# EAGLE design Pure Power Strip (EAGLE 9.6.2)
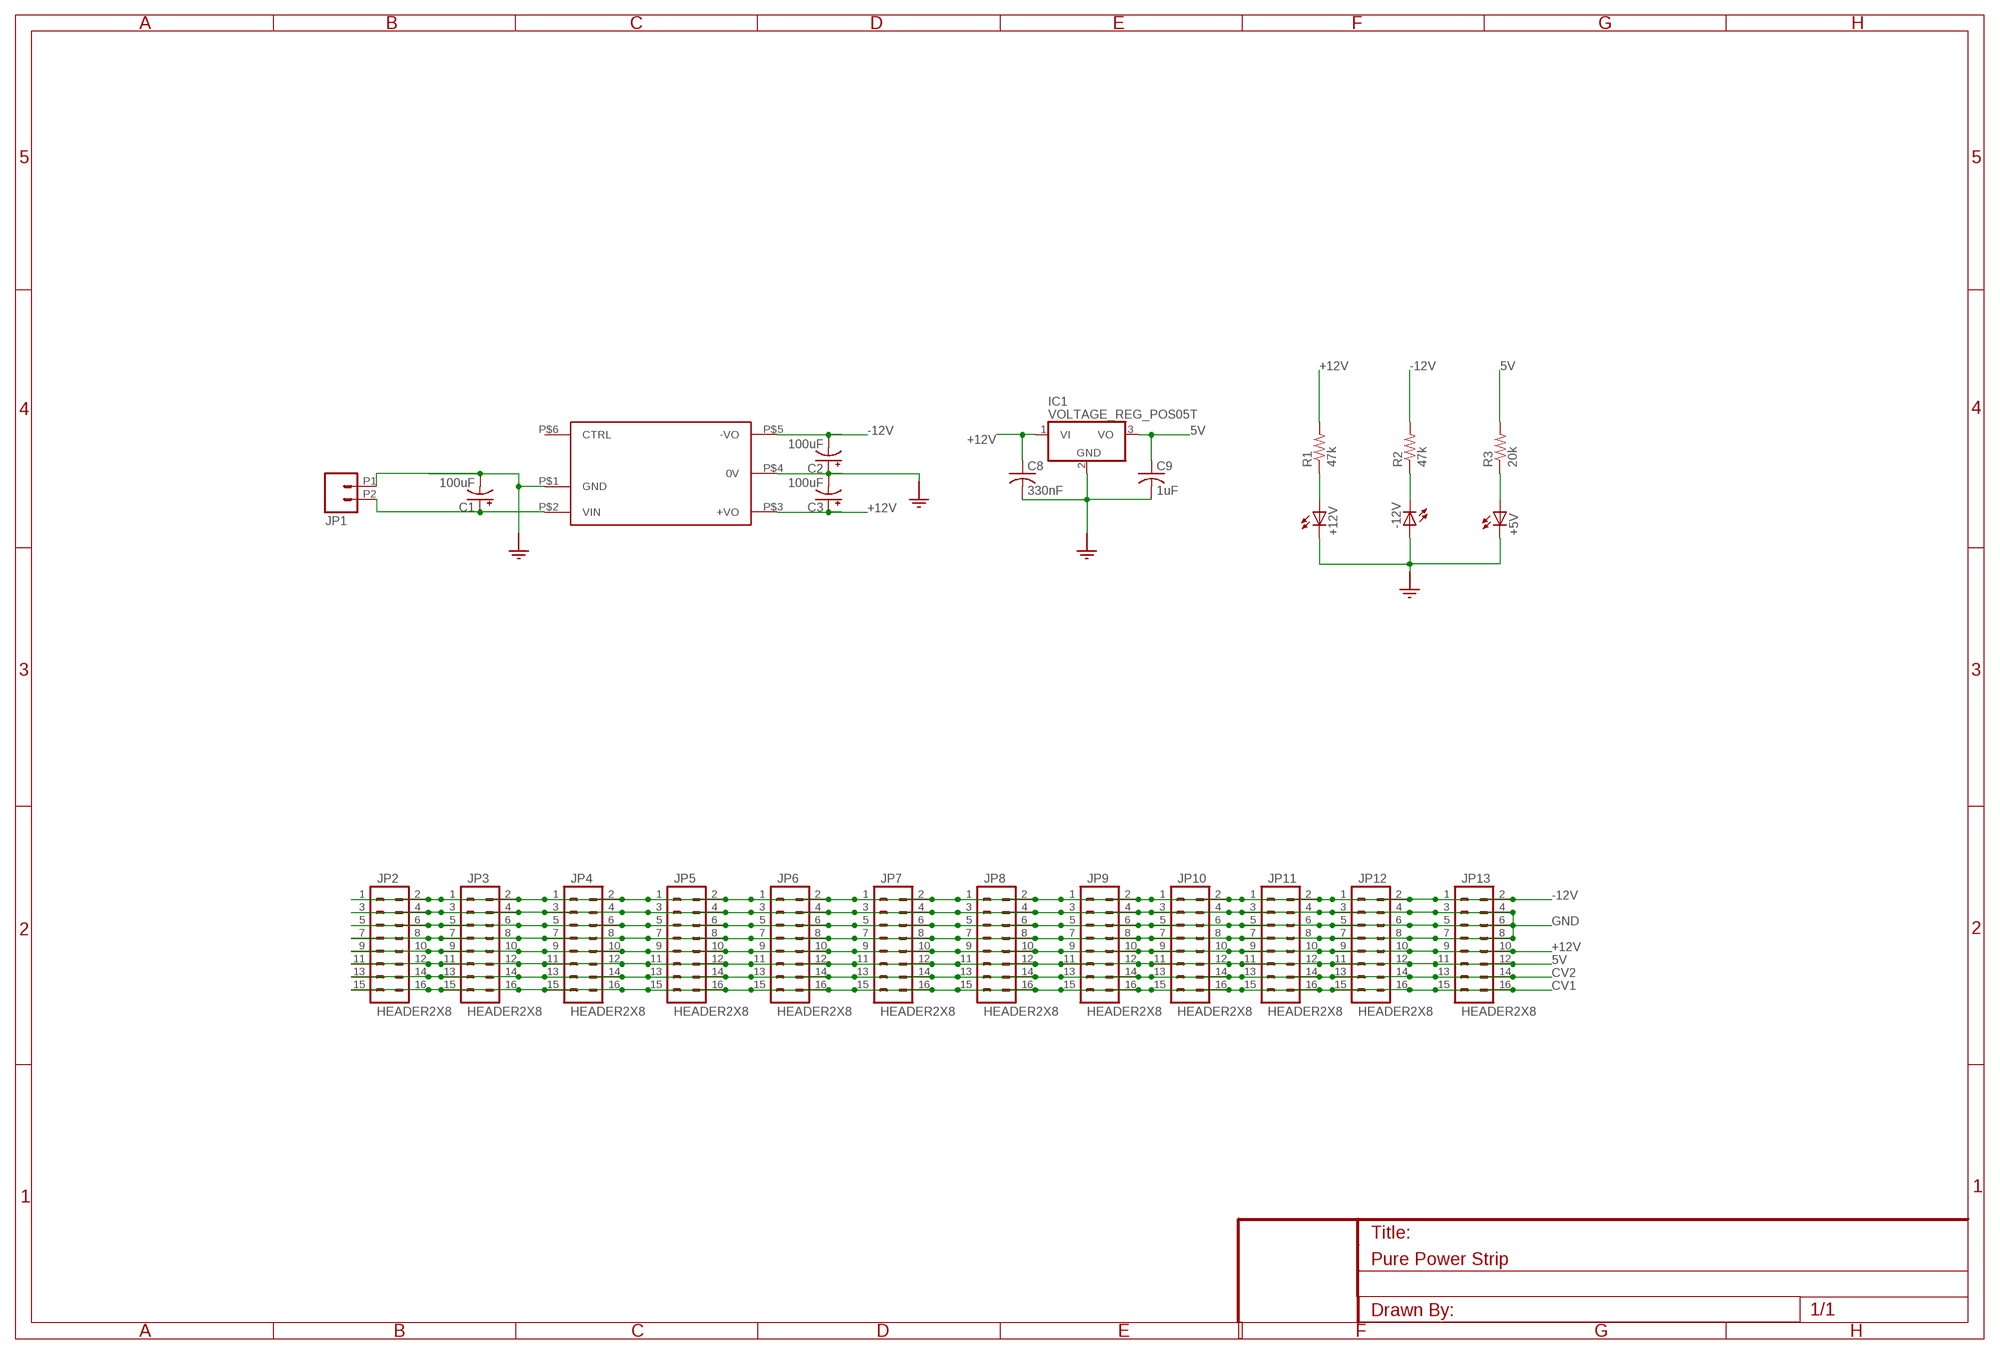
[diagram p0: schematic, sheet 1]

## Parts
+5V  LED5MM  [LED5MM]
+12V  LED5MM  [LED5MM]
-12V  LED5MM  [LED5MM]
C1  100uF  CAPACITOR_POL-US0511/2.24  [0511/2.24]
C2  100uF  CAPACITOR_POL-US0511/2.24  [0511/2.24]
C3  100uF  CAPACITOR_POL-US0511/2.24  [0511/2.24]
C8  330nF  CAPACITOR-US025-024X044  [C025-024X044]
C9  1uF  CAPACITOR-US025-024X044  [C025-024X044]
IC1  VOLTAGE_REG_POS05T  [TO220H]
JP1  HEADER1X25MM_SCREWTERM  [1X02_5MM_SCREWTERM]
JP2  HEADER2X8  [POWER_SHROUDED]
JP3  HEADER2X8  [POWER_SHROUDED]
JP4  HEADER2X8  [POWER_SHROUDED]
JP5  HEADER2X8  [POWER_SHROUDED]
JP6  HEADER2X8  [POWER_SHROUDED]
JP7  HEADER2X8  [POWER_SHROUDED]
JP8  HEADER2X8  [POWER_SHROUDED]
JP9  HEADER2X8  [POWER_SHROUDED]
JP10  HEADER2X8  [POWER_SHROUDED]
JP11  HEADER2X8  [POWER_SHROUDED]
JP12  HEADER2X8  [POWER_SHROUDED]
JP13  HEADER2X8  [POWER_SHROUDED]
R1  47k  RESISTOR_US0207/8.5  [0207/8.5]
R2  47k  RESISTOR_US0207/8.5  [0207/8.5]
R3  20k  RESISTOR_US0207/8.5  [0207/8.5]
U$1  DCDC_CONVERTER_URA241XLD-20WR3  [URA241XLD-20WR3]

## Nets
5V: C9.1 IC1.3(VO) JP2.11 JP2.12 JP3.11 JP3.12 JP4.11 JP4.12 JP5.11 JP5.12 JP6.11 JP6.12 JP7.11 JP7.12 JP8.11 JP8.12 JP9.11 JP9.12 JP10.11 JP10.12 JP11.11 JP11.12 JP12.11 JP12.12 JP13.11 JP13.12 R3.2
+12V: C3.P$2(+) C8.1 IC1.1(VI) JP2.9 JP2.10 JP3.9 JP3.10 JP4.9 JP4.10 JP5.9 JP5.10 JP6.9 JP6.10 JP7.9 JP7.10 JP8.9 JP8.10 JP9.9 JP9.10 JP10.9 JP10.10 JP11.9 JP11.10 JP12.9 JP12.10 JP13.9 JP13.10 R1.2 U$1.P$3(+VO)
-12V: C2.P$1(-) JP2.1 JP2.2 JP3.1 JP3.2 JP4.1 JP4.2 JP5.1 JP5.2 JP6.1 JP6.2 JP7.1 JP7.2 JP8.1 JP8.2 JP9.1 JP9.2 JP10.1 JP10.2 JP11.1 JP11.2 JP12.1 JP12.2 JP13.1 JP13.2 R2.2 U$1.P$5(-VO)
CV1: JP2.15 JP2.16 JP3.15 JP3.16 JP4.15 JP4.16 JP5.15 JP5.16 JP6.15 JP6.16 JP7.15 JP7.16 JP8.15 JP8.16 JP9.15 JP9.16 JP10.15 JP10.16 JP11.15 JP11.16 JP12.15 JP12.16 JP13.15 JP13.16
CV2: JP2.13 JP2.14 JP3.13 JP3.14 JP4.13 JP4.14 JP5.13 JP5.14 JP6.13 JP6.14 JP7.13 JP7.14 JP8.13 JP8.14 JP9.13 JP9.14 JP10.13 JP10.14 JP11.13 JP11.14 JP12.13 JP12.14 JP13.13 JP13.14
GND: +5V.K(C) +12V.K(C) -12V.A C1.P$1(-) C2.P$2(+) C3.P$1(-) C8.2 C9.2 IC1.2(GND) JP1.P1 JP2.3 JP2.4 JP2.5 JP2.6 JP2.7 JP2.8 JP3.3 JP3.4 JP3.5 JP3.6 JP3.7 JP3.8 JP4.3 JP4.4 JP4.5 JP4.6 JP4.7 JP4.8 JP5.3 JP5.4 JP5.5 JP5.6 JP5.7 JP5.8 JP6.3 JP6.4 JP6.5 JP6.6 JP6.7 JP6.8 JP7.3 JP7.4 JP7.5 JP7.6 JP7.7 JP7.8 JP8.3 JP8.4 JP8.5 JP8.6 JP8.7 JP8.8 JP9.3 JP9.4 JP9.5 JP9.6 JP9.7 JP9.8 JP10.3 JP10.4 JP10.5 JP10.6 JP10.7 JP10.8 JP11.3 JP11.4 JP11.5 JP11.6 JP11.7 JP11.8 JP12.3 JP12.4 JP12.5 JP12.6 JP12.7 JP12.8 JP13.3 JP13.4 JP13.5 JP13.6 JP13.7 JP13.8 U$1.P$1(GND) U$1.P$4(0V)
N$3: C1.P$2(+) JP1.P2 U$1.P$2(VIN)
N$4: +12V.A R1.1
N$5: -12V.K(C) R2.1
N$6: +5V.A R3.1
Unconnected: U$1.P$6(CTRL)

## Library data of the parts
+5V +12V -12V = GMSN:LED: LED OSRAM: - CHIPLED LG R971, LG N971, LY N971, LG Q971, LY Q971, LO R971, LY R971 LH N974, LH R974 LS Q976, LO Q976, LY Q976 LO Q996 - Hyper CHIPLED LW Q18S LB Q993, LB Q99A, LB R99A - SideLED LS A670, LO A670, LY A670, LG A670, LP A670 LB A673, LV A673, LT A673, LW A673 LH A674 LY A675 LS A676, LA A676, LO A676, LY A676, LW A676 LS A679, LY A679, LG A679 - Hyper Micro SIDELED® LS Y876, LA Y876, LO Y876, LY Y876 LT Y87S - SmartLED LW L88C, LW L88S LB L89C, LB L89S, LG L890 LS L89K, LO L89K, LY L89K LS L896, LA L896, LO L896, LY L896 - TOPLED LS T670, LO T670, LY T670, LG T670, LP T670 LSG T670, LSP T670, LSY T670, LOP T670, LYG T670 LG T671, LOG T671, LSG T671 LB T673, LV T673, LT T673, LW T673 LH T674 LS T676, LA T676, LO T676, LY T676, LB T676, LH T676, LSB T676, LW T676 LB T67C, LV T67C, LT T67C, LS T67K, LO T67K, LY T67K, LW E67C LS E67B, LA E67B, LO E67B, LY E67B, LB E67C, LV E67C, LT E67C LW T67C LS T679, LY T679, LG T679 LS T770, LO T770, LY T770, LG T770, LP T770 LB T773, LV T773, LT T773, LW T773 LH T774 LS E675, LA E675, LY E675, LS T675 LS T776, LA T776, LO T776, LY T776, LB T776 LHGB T686 LT T68C, LB T68C - Hyper Mini TOPLED® LB M676 - Mini TOPLED Santana® LG M470 LS M47K, LO M47K, LY M47K Source: http://www.osram.convergy.de/; SORT: 9
C1-C3 = GMSN:CAPACITOR_POL-US: Electro Capacitor; SORT: 6
C8 C9 = GMSN:CAPACITOR-US: Capacitor; SORT: 3
IC1 = GMSN:VOLTAGE_REG_POS: Positive Voltage Regulator Added bigger pads to the TO-92 package
JP1 = GMSN:HEADER1X2: Header 1x2
JP2-JP13 = GMSN:HEADER2X8: 16 Pin Header 2x8; SORT: 7
R1-R3 = GMSN:RESISTOR_US: Resistor; SORT: 2
U$1 = GMSN:DCDC_CONVERTER_URA241XLD-20WR3

## Board
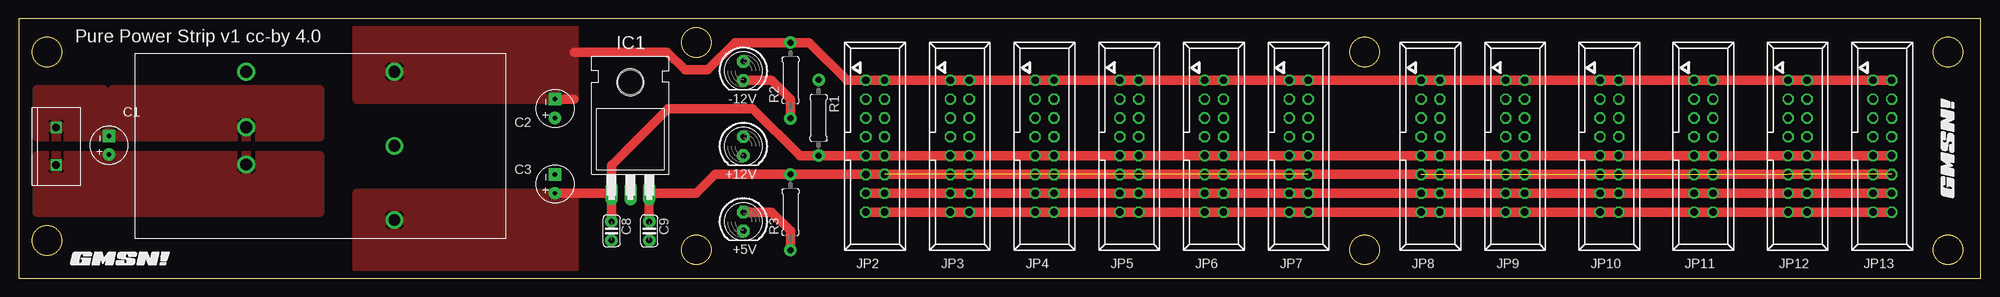
[diagram p1: board, top side]
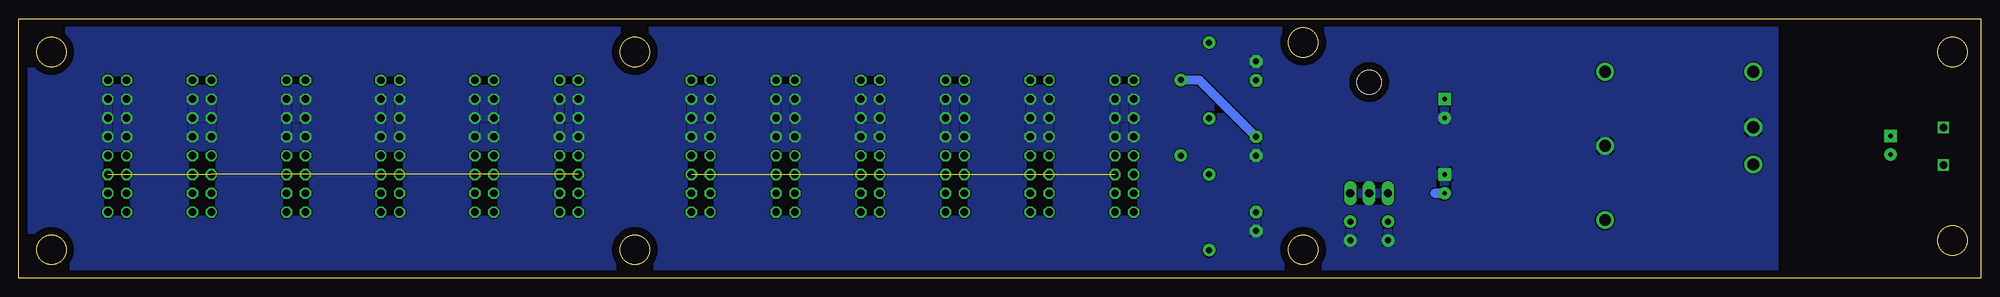
[diagram p2: board, bottom side, seen from below]

Size 264.77 x 35 mm. Coordinates in mm from the lower left corner, seen from the top.
Outline: 0,0 264.77,0 264.77,35 0,35 0,0
Outline: circle at 3.81,30.48 radius 2
Outline: circle at 3.81,5.08 radius 2
Outline: circle at 260.35,30.48 radius 2
Outline: circle at 260.35,3.81 radius 2
Outline: circle at 91.44,31.75 radius 2
Outline: circle at 91.44,3.81 radius 2
Outline: circle at 181.61,30.48 radius 2
Outline: circle at 181.61,3.81 radius 2
Copper layers (1*16): Top 0.035mm / dielectric 1.5mm / Bottom 0.035mm
Design rules "default": minimum track width 6mil, minimum drill 0.35mm, track to track 6mil, track to pad 6mil, pad to pad 6mil, via to via 6mil, smd to smd 6mil, copper to edge 40mil, drill to drill 6mil, minimum pad ring 10mil, minimum via ring 8mil, stop-mask expansion 4mil, vias tented up to drill 0mil, thermal gap 10mil

### Footprints (pad centres in the part's own frame; a part is rotated, then mirrored left to right if it is on the bottom)
LED5MM = drill 0.813 pad 1.676 octagon: A -1.27,0; K 1.27,0
0511/2.24 = drill 0.6 pad 1.676 square: P$1 -1.27,0 | drill 0.6 pad 1.676: P$2 1.27,0
C025-024X044 = drill 0.813 pad 1.676: 1 -1.27,0; 2 1.27,0
TO220H = drill 1.118 long: 1 -2.54,-10.16; 2 0,-10.16; 3 2.54,-10.16 | hole 3.302: 0,4.826
1X02_5MM_SCREWTERM = drill 1.016 square: P1 5.08,0; P2 0,0
POWER_SHROUDED = drill 1 octagon: 1 -8.89,-1.27; 2 -8.89,1.27; 3 -6.35,-1.27; 4 -6.35,1.27; 5 -3.81,-1.27; 6 -3.81,1.27; 7 -1.27,-1.27; 8 -1.27,1.27; 9 1.27,-1.27; 10 1.27,1.27; 11 3.81,-1.27; 12 3.81,1.27; 13 6.35,-1.27; 14 6.35,1.27; 15 8.89,-1.27; 16 8.89,1.27
0207/8.5 = drill 0.813 pad 1.676: 1 -5.139,0; 2 5.08,0
URA241XLD-20WR3 = drill 1.6: P$1 -15,0; P$2 -15,-5; P$3 5,-12.5; P$4 5,-2.5; P$5 5,7.5; P$6 -15,7.5

### Placement (x,y rotation side)
+5V  97.79,7.62 270 top
+12V  97.79,17.78 270 top
-12V  97.79,27.94 270 top
C1  12.19,17.91 270 top
C2  72.39,22.86 270 top
C3  72.39,12.7 270 top
C8  80.01,6.35 270 top
C9  85.09,6.35 270 top
IC1  82.55,21.59 0 top
JP1  5.08,15.24 90 top
JP2  115.57,17.78 270 top
JP3  127,17.78 270 top
JP4  138.43,17.78 270 top
JP5  149.86,17.78 270 top
JP6  161.29,17.78 270 top
JP7  172.72,17.78 270 top
JP8  190.5,17.78 270 top
JP9  201.93,17.78 270 top
JP10  214.63,17.78 270 top
JP11  227.33,17.78 270 top
JP12  240.03,17.78 270 top
JP13  251.46,17.78 270 top
R1  107.95,21.59 270 top
R2  104.14,26.67 90 top
R3  104.14,8.89 90 top
U$1  45.72,20.32 0 top
U$14  [GMSN!_LOGO]  260.35,17.78 90 top
U$15  [GMSN!_LOGO]  13.97,2.54 0 top

### Tracks (layer width: path | path; a pad name or v marks a point on that pad's centre or on a via)
5V  (21 unrouted)
  Top 1.27: JP13.12 JP2.12 JP2.11 R3.2 93.98,13.97 91.44,11.43 IC1.3 C9.1
+12V
  Top 1.27: IC1.1 C3.P$2 | C8.1 IC1.1 | JP5.10 JP6.9 JP6.10 JP7.9 JP7.10 JP8.9 JP8.10 JP9.9 JP9.10 JP10.9 JP10.10 JP11.9 JP11.10 JP12.9 JP12.10 JP13.9 JP13.10 | JP5.10 149.86,16.51 | JP5.10 JP5.9 JP4.10 JP4.9 JP3.10 JP3.9 JP2.10 JP2.9 R1.2 105.41,16.51 99.06,22.86 87.63,22.86 80.01,15.24 IC1.1
  Bottom 1.27: 73.66,11.43 C3.P$2
  pour Top: 45.72,11.43 74.93,11.43 74.93,1.27 45.72,1.27
-12V
  Top 1.27: 74.93,24.13 C2.P$1 | JP5.1 JP4.2 JP4.1 JP3.2 JP3.1 JP2.2 JP2.1 111.76,26.67 106.68,31.75 R2.2 96.66,31.75 92.97,28.06 89.91,28.06 87.49,30.48 74.93,30.48 | JP5.1 149.86,26.67 | JP5.1 JP5.2 JP6.1 JP6.2 JP7.1 JP7.2 JP8.1 JP8.2 JP9.1 JP9.2 JP10.1 JP10.2 JP11.1 JP11.2 JP12.1 JP12.2 JP13.1 JP13.2
  pour Top: 74.93,34.29 74.93,24.13 45.72,24.13 45.72,34.29
CV1
  Top 1.27: JP2.15 JP2.16 JP3.15 JP3.16 JP4.15 JP4.16 JP5.15 JP5.16 JP6.15 JP6.16 JP7.15 JP7.16 JP8.15 JP8.16 JP9.15 JP9.16 JP10.15 JP10.16 JP11.15 JP11.16 JP12.15 JP12.16 JP13.15 JP13.16
CV2
  Top 1.27: JP2.13 JP2.14 JP3.13 JP3.14 JP4.13 JP4.14 JP5.13 JP5.14 JP6.13 JP6.14 JP7.13 JP7.14 JP8.13 JP8.14 JP9.13 JP9.14 JP10.13 JP10.14 JP11.13 JP11.14 JP12.13 JP12.14 JP13.13 JP13.14
GND
  pour Top: 40.64,25.4 40.64,19.05 2.54,19.05 2.54,25.4 11.43,25.4 11.43,20.7 12.7,20.7 12.7,25.4
  pour Bottom: 27.94,35.56 262.89,35.56 262.89,0 27.94,0
N$3
  pour Top: 40.64,8.89 40.64,16.51 2.54,16.51 2.54,8.89
N$4
  Bottom 1.27: R1.1 105.41,26.67 +12V.A
N$5
  Top 1.27: -12V.K 101.6,26.67 104.14,24.13 R2.1
N$6
  Top 1.27: +5V.A 101.6,8.89 104.14,6.35 R3.1

### Text on the board
tNames: Pure Power Strip v1 cc-by 4.0